# EAGLE design femtoBeacon_PRO_r3.0.2_single_sided (EAGLE 7.6.0)

## Sheet 1 of 2
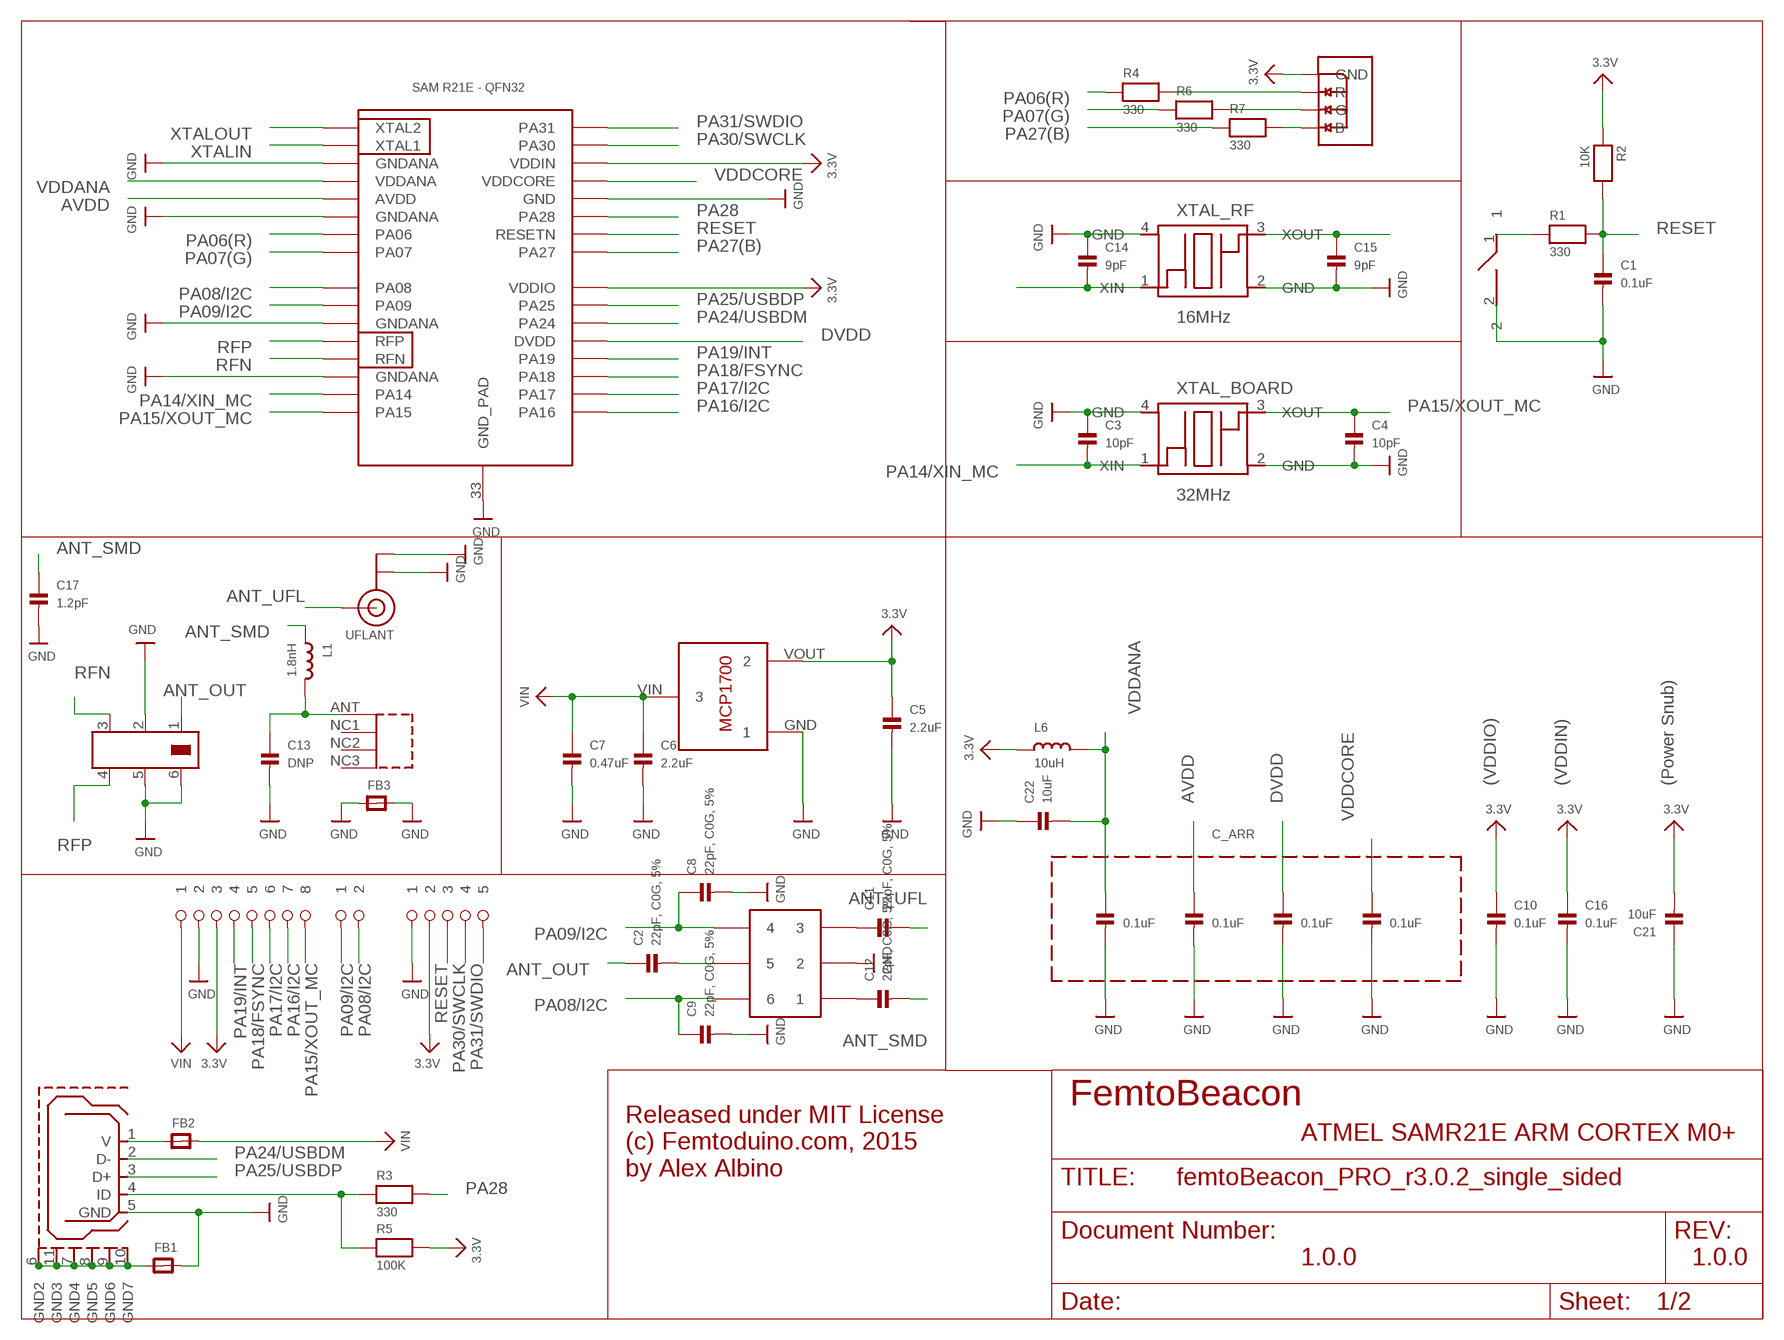
[diagram p0: schematic, sheet 1]

### Parts
ASWITCH  AS222-92LF  [AS222-92LF]
BALUN  JOHANSON_2450BM15A0015E  [0805_BALUN]
BTN_RESET  DNP  SPST_SMD  [SPST_SMD]
C1  0.1uF  CAP_CERAMIC_0402MP  [_0402MP]
C2  22pF, C0G, 5%  CAP_CERAMIC_0402MP  [_0402MP]
C3  10pF  CAP_CERAMIC_0402MP  [_0402MP]
C4  10pF  CAP_CERAMIC_0402MP  [_0402MP]
C5  2.2uF  CAP_CERAMIC_0402MP  [_0402MP]
C6  2.2uF  CAP_CERAMIC_0402MP  [_0402MP]
C7  0.47uF  CAP_CERAMIC_0402MP  [_0402MP]
C8  22pF, C0G, 5%  CAP_CERAMIC_0402MP  [_0402MP]
C9  22pF, C0G, 5%  CAP_CERAMIC_0402MP  [_0402MP]
C10  0.1uF  CAP_CERAMIC_0402MP  [_0402MP]
C11  22pF, C0G, 5%  CAP_CERAMIC_0402MP  [_0402MP]
C12  22pF, C0G, 5%  CAP_CERAMIC_0402MP  [_0402MP]
C13  DNP  CAP_CERAMIC_0402MP  [_0402MP]
C14  9pF  CAP_CERAMIC_0402MP  [_0402MP]
C15  9pF  CAP_CERAMIC_0402MP  [_0402MP]
C16  0.1uF  CAP_CERAMIC_0402MP  [_0402MP]
C17  1.2pF  CAP_CERAMIC_0402MP  [_0402MP]
C21  10uF  CAP_CERAMIC_0402MP  [_0402MP]
C22  10uF  CAP_CERAMIC_0402MP  [_0402MP]
C_ARR  0.1uF  KEMET_CERAMIC_CAPACITOR_ARRAY_1X4  [CAPACITOR_ARRAY_1206_MONO_1X4]
FB1  FERRITE_0603MP  [_0603MP]
FB2  FERRITE_0603MP  [_0603MP]
FB3  FERRITE_0603MP  [_0603MP]
IC  ATSAMR21E18A-MUT  [QFN32]
L1  1.8nH  INDUCTOR_0603MP  [_0603MP]
L6  10uH  INDUCTOR_0603MP  [_0603MP]
LDO_VREG  MCP1700T-3302E/TT  [MCP1700T-3302E/TT]
R1  330  RESISTOR_0402MP  [_0402MP]
R2  10K  RESISTOR_0402MP  [_0402MP]
R3  330  RESISTOR_0402MP  [_0402MP]
R4  330  RESISTOR_0402MP  [_0402MP]
R5  100K  RESISTOR_0402MP  [_0402MP]
R6  330  RESISTOR_0402MP  [_0402MP]
R7  330  RESISTOR_0402MP  [_0402MP]
RGBLED  LRTB_R48G  [LRTB_R48G]
U$5  1X8_ROUND  [1X8_ROUND]
U$9  1X2_ROUND  [1X2_ROUND]
U$10  1X5_ROUND  [1X5_ROUND]
U$12  0479480001  [0479480001]
UFLANT  ANTENNA_U.FL  [U.FL]
USB  USB_MICROB  [USB_MICROB_PACKAGE]
XTAL_BOARD  32MHz  FA-128  [FA-128]
XTAL_RF  16MHz  TSX-3225  [TSX-3225]

### Nets
3.3V: C5.1 C10.1 C16.1 C21.2 IC.24(VDDIO) IC.30(VDDIN) L6.1 LDO_VREG.VOUT R2.1 R5.2 RGBLED.1(GND) U$5.P$3 U$10.P$2 ; also sheet 2
ANT_OUT: BALUN.1 C2.1
ANT_SMD: C12.2 C17.1 L1.1
ANT_UFL: C11.2 UFLANT.3(SIGNAL)
AVDD: C_ARR.3 IC.5(AVDD)
DVDD: C_ARR.5 IC.21(DVDD)
GND: ASWITCH.PIN2 BALUN.2 BALUN.5 BALUN.6 BTN_RESET.2 C1.2 C3.1 C4.2 C5.2 C6.2 C7.2 C8.2 C9.2 C10.2 C13.2 C14.1 C15.2 C16.2 C17.2 C21.1 C22.1 C_ARR.2 C_ARR.4 C_ARR.6 C_ARR.8 FB1.2 FB3.1 FB3.2 IC.3(GNDANA) IC.6(GNDANA) IC.11(GNDANA) IC.14(GNDANA) IC.28(GND) IC.33(GND_PAD) LDO_VREG.GND U$5.P$2 U$10.P$1 UFLANT.1(GND) UFLANT.2(GND) USB.5(GND) XTAL_BOARD.2(GND) XTAL_BOARD.4(GND) XTAL_RF.2(GND) XTAL_RF.4(GND) ; also sheet 2
N$2: C13.1 L1.2 U$12.ANT
N$3: ASWITCH.PIN5 C2.2
N$5: FB1.1 USB.6(GND2) USB.7(GND4) USB.8(GND5) USB.9(GND6) USB.10(GND7) USB.11(GND3)
N$6: R3.1 R5.1 USB.4(ID)
N$7: FB2.1 USB.1(V)
N$8: R6.2 RGBLED.3(G)
N$9: R7.2 RGBLED.4(B)
N$10: ASWITCH.PIN3 C11.1
N$11: ASWITCH.PIN1 C12.1
N$13: R4.2 RGBLED.2(R)
N$26: BTN_RESET.1 R1.1
PA06(R): IC.7(PA06) R4.1
PA07(G): IC.8(PA07) R6.1
PA08/I2C: ASWITCH.PIN6 C9.1 IC.9(PA08) U$9.P$2
PA09/I2C: ASWITCH.PIN4 C8.1 IC.10(PA09) U$9.P$1
PA14/XIN_MC: C3.2 IC.15(PA14) XTAL_BOARD.1(XIN)
PA15/XOUT_MC: C4.1 IC.16(PA15) U$5.P$8 XTAL_BOARD.3(XOUT)
PA16/I2C: IC.17(PA16) U$5.P$7 ; also sheet 2
PA17/I2C: IC.18(PA17) U$5.P$6 ; also sheet 2
PA18/FSYNC: IC.19(PA18) U$5.P$5 ; also sheet 2
PA19/INT: IC.20(PA19) U$5.P$4 ; also sheet 2
PA24/USBDM: IC.22(PA24) USB.2(D-)
PA25/USBDP: IC.23(PA25) USB.3(D+)
PA27(B): IC.25(PA27) R7.1
PA28: IC.27(PA28) R3.2
PA30/SWCLK: IC.31(PA30) U$10.P$4
PA31/SWDIO: IC.32(PA31) U$10.P$5
RESET: C1.1 IC.26(RESETN) R1.2 R2.2 U$10.P$3
RFN: BALUN.3 IC.13(RFN)
RFP: BALUN.4 IC.12(RFP)
VDDANA: C22.2 C_ARR.1 IC.4(VDDANA) L6.2
VDDCORE: C_ARR.7 IC.29(VDDCORE)
VIN: C6.1 C7.1 FB2.2 LDO_VREG.VIN U$5.P$1
XTALIN: C14.2 IC.2(XTAL1) XTAL_RF.1(XIN)
XTALOUT: C15.1 IC.1(XTAL2) XTAL_RF.3(XOUT)
Unconnected: U$12.NC1 U$12.NC2 U$12.NC3

### Notes on the sheet
- (VDDIO) | (VDDIN) | (Power Snub)
- FemtoBeacon
- ATMEL SAMR21E ARM CORTEX M0+
- Released under MIT License
  (c) Femtoduino.com, 2015
  by Alex Albino
- 1.0.0 | 1.0.0

## Sheet 2 of 2
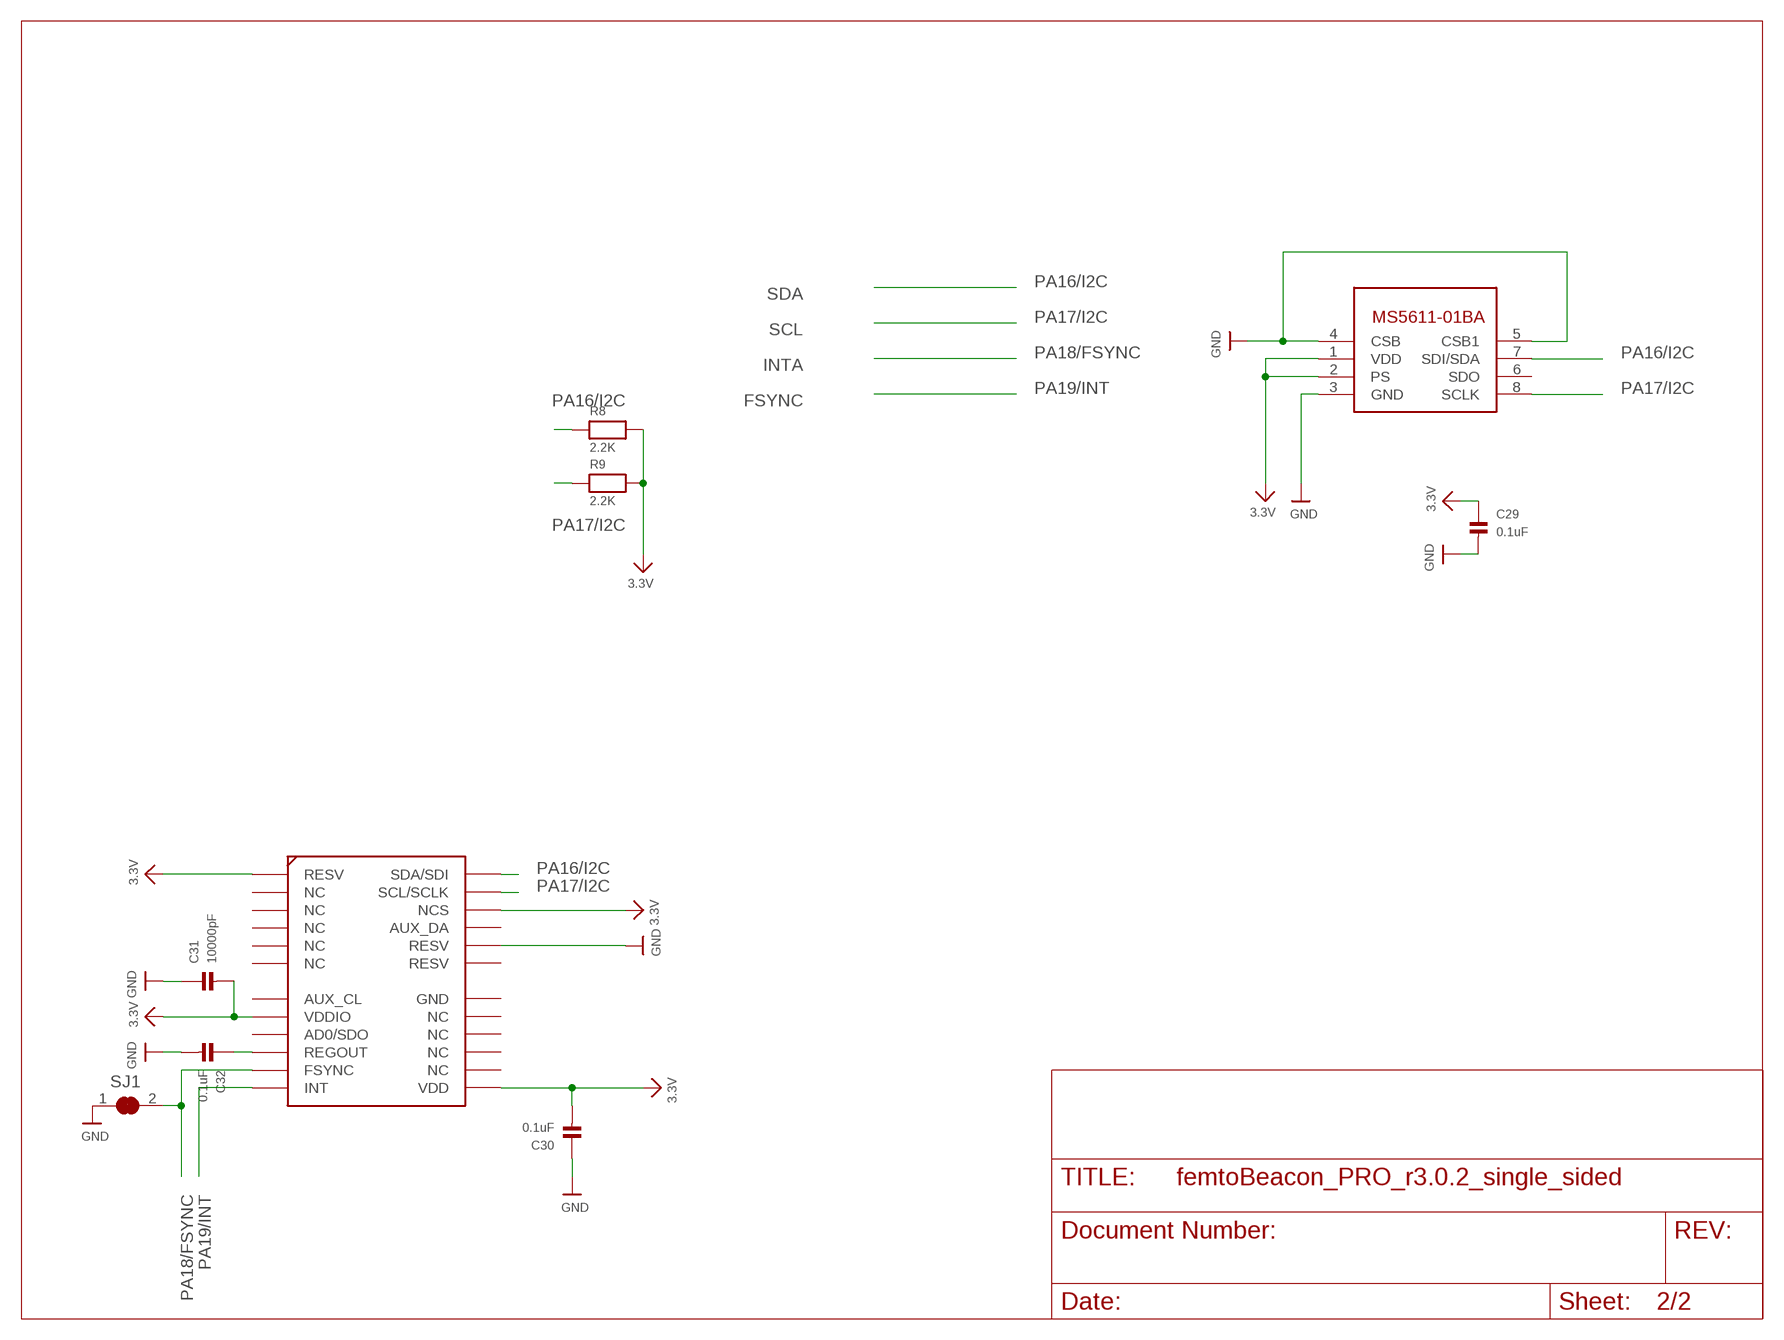
[diagram p1: schematic, sheet 2]

### Parts
BARO  MS5611-01BA03  [MS5611-01BA03]
C29  0.1uF  CAP_CERAMIC_0402MP  [_0402MP]
C30  0.1uF  CAP_CERAMIC_0402MP  [_0402MP]
C31  10000pF  CAP_CERAMIC_0402MP  [_0402MP]
C32  0.1uF  CAP_CERAMIC_0402MP  [_0402MP]
IMU  MPU-9250  [QFN_3X3MM]
R8  2.2K  RESISTOR_0402MP  [_0402MP]
R9  2.2K  RESISTOR_0402MP  [_0402MP]
SJ1  SOLDERJUMPER_CLOSED  [SOLDERJUMPER_CLOSEDWIRE]

### Nets
3.3V: BARO.1(VDD) BARO.2(PS) C29.1 C30.2 C31.2 IMU.P$1(RESV) IMU.P$8(VDDIO) IMU.P$13(VDD) IMU.P$22(NCS) R8.2 R9.2 ; also sheet 1
GND: BARO.3(GND) BARO.4(CSB) BARO.5(CSB1) C29.2 C30.1 C31.1 C32.2 IMU.P$20(RESV) SJ1.1 ; also sheet 1
N$4: C32.1 IMU.P$10(REGOUT)
PA16/I2C: BARO.7(SDI/SDA) IMU.P$24(SDA/SDI) R8.1 ; also sheet 1
PA17/I2C: BARO.8(SCLK) IMU.P$23(SCL/SCLK) R9.1 ; also sheet 1
PA18/FSYNC: IMU.P$11(FSYNC) SJ1.2 ; also sheet 1
PA19/INT: IMU.P$12(INT) ; also sheet 1
Unconnected: BARO.6(SDO) IMU.P$2(NC) IMU.P$3(NC) IMU.P$4(NC) IMU.P$5(NC) IMU.P$6(NC) IMU.P$7(AUX_CL) IMU.P$9(AD0/SDO) IMU.P$14(NC) IMU.P$15(NC) IMU.P$16(NC) IMU.P$17(NC) IMU.P$18(GND) IMU.P$19(RESV) IMU.P$21(AUX_DA)

### Notes on the sheet
- SDA
- SCL
- INTA
- FSYNC

## Library data of the parts
ASWITCH = skyworks_solutions:AS222-92LF
BALUN = balun:JOHANSON_2450BM15A0015E
BARO = freeimu:MS5611-01BA03
BTN_RESET = femtoduino:SPST_SMD
C1-C4 C8-C16 C29-C32 = microbuilder:CAP_CERAMIC: Ceramic Capacitors 0402 - 0402 Surface Mount Capacitors 16pF 50V 5% [Digikey: 445-4899-2-ND] 18pF 50V 5% [Digikey: 490-1281-2-ND] 22pF 50V 5% [Digikey: 490-1283-2-ND] 68pF 50V 5% [Digikey: 490-1289-2-ND] 0.1uF 10V 10% [Digikey: 490-1318-2-ND] 1.0uF 6.3V 10% [Digikey: 490-1320-2-ND] 0603 - 0603 Surface Mount Capacitors 16 pF 50V 5% [Digikey: 445-5051-2-ND] 22 pF 50V [Digikey: PCC220ACVTR-ND] 33 pF 50V 5% [Digikey: 490-1415-1-ND] 56pF 50V 5% [Digikey: 490-1421-1-ND] 220pF 50V 5% [Digikey: 445-1285-1-ND] 680 pF 50V 2200 pF 50V 5% C0G [Digikey: 445-1297-1-ND] 5600 pF 100V 5% X7R [Digikey: 478-3711-1-ND] 0.1 µF 25V 10% [Digikey: PCC2277TR-ND] 0.22 µF 16V 10% X7R [Digikey: 445-1318-1-ND] 1.0 µF 25V 10% [Digikey: 445-5146-2-ND] 0603 - RF Specific 3pF 250V +/-0.1pF RF [Digikey: 712-1347-1-ND] 18 pF 250V 5% [Digikey: 478-3505-1-ND or 712-1322-1-ND] 56 pF 250V 5% C0G RF [Digikey: 490-4867-1-ND] 68 pF 250V RF [Digikey: 490-4868-1-ND] 0805 - 0805 Surface Mount Capacitors 220 pF 250V 2% RF Ceramic Capacitor [Digikey: 712-1398-1-ND] 1000 pF 50V 2% NP0 Ceramic Capacitor [Digikey: 478-3760-1-ND] 0.1 µF 25V 10% Ceramic Capacitor [Digikey: PCC1828TR-ND] 1.0 µF 16V 10% Ceramic Capacitor[Digikey: 490-1691-2-ND] 10.0 µF 10V 10% Ceramic Capacitor[Digikey: 709-1228-1-ND] 10.0 uF 16V 10% Ceramic Capacitor [Digikey: 478-5165-2-ND] 47 uF 6.3V 20% Ceramic Capacitor [Digikey: 587-1779-1-ND or 399-5506-1-ND] 1206 - 1206 Surface Mount Capacitors 47uF 10V 20% Ceramic Capacitor [Digikey: 490-5528-1-ND or 399-5508-1-ND or 445-6010-1-ND] 100uF 6.3V -20%, +80% Y5V Ceramic Capacitor (Digikey: 490-4512-1-ND, Mouser: 81-GRM31CF50J107ZE1L); DIGIKEY_PART: 490-3194-1-ND
C5-C7 C17 C21 C22 = microbuilder:CAP_CERAMIC: Ceramic Capacitors 0402 - 0402 Surface Mount Capacitors 16pF 50V 5% [Digikey: 445-4899-2-ND] 18pF 50V 5% [Digikey: 490-1281-2-ND] 22pF 50V 5% [Digikey: 490-1283-2-ND] 68pF 50V 5% [Digikey: 490-1289-2-ND] 0.1uF 10V 10% [Digikey: 490-1318-2-ND] 1.0uF 6.3V 10% [Digikey: 490-1320-2-ND] 0603 - 0603 Surface Mount Capacitors 16 pF 50V 5% [Digikey: 445-5051-2-ND] 22 pF 50V [Digikey: PCC220ACVTR-ND] 33 pF 50V 5% [Digikey: 490-1415-1-ND] 56pF 50V 5% [Digikey: 490-1421-1-ND] 220pF 50V 5% [Digikey: 445-1285-1-ND] 680 pF 50V 2200 pF 50V 5% C0G [Digikey: 445-1297-1-ND] 5600 pF 100V 5% X7R [Digikey: 478-3711-1-ND] 0.1 µF 25V 10% [Digikey: PCC2277TR-ND] 0.22 µF 16V 10% X7R [Digikey: 445-1318-1-ND] 1.0 µF 25V 10% [Digikey: 445-5146-2-ND] 0603 - RF Specific 3pF 250V +/-0.1pF RF [Digikey: 712-1347-1-ND] 18 pF 250V 5% [Digikey: 478-3505-1-ND or 712-1322-1-ND] 56 pF 250V 5% C0G RF [Digikey: 490-4867-1-ND] 68 pF 250V RF [Digikey: 490-4868-1-ND] 0805 - 0805 Surface Mount Capacitors 220 pF 250V 2% RF Ceramic Capacitor [Digikey: 712-1398-1-ND] 1000 pF 50V 2% NP0 Ceramic Capacitor [Digikey: 478-3760-1-ND] 0.1 µF 25V 10% Ceramic Capacitor [Digikey: PCC1828TR-ND] 1.0 µF 16V 10% Ceramic Capacitor[Digikey: 490-1691-2-ND] 10.0 µF 10V 10% Ceramic Capacitor[Digikey: 709-1228-1-ND] 10.0 uF 16V 10% Ceramic Capacitor [Digikey: 478-5165-2-ND] 47 uF 6.3V 20% Ceramic Capacitor [Digikey: 587-1779-1-ND or 399-5506-1-ND] 1206 - 1206 Surface Mount Capacitors 47uF 10V 20% Ceramic Capacitor [Digikey: 490-5528-1-ND or 399-5508-1-ND or 445-6010-1-ND] 100uF 6.3V -20%, +80% Y5V Ceramic Capacitor (Digikey: 490-4512-1-ND, Mouser: 81-GRM31CF50J107ZE1L)
C_ARR = array-capacitor:KEMET_CERAMIC_CAPACITOR_ARRAY_1X4; MFR_ID: CA064C104K4RACTU
FB1-FB3 = microbuilder:FERRITE: Ferrite Bead 0603 MMZ1608B121C - 120 Ohm @ 100MHz, 600mA, 0.15 Ohm DC Resistance - Digikey: 445-2164-1-ND BK1608HW121-T - 120 Ohm, 600mA Ferrite Chip - Digikey: 587-1876-2-ND 0805 HZ0805B272R-10 - 2.7K Ohm @ 100MHz, 200mA, 0.8 Ohm DC Resistance - Digikey: 240-2504-1-ND (see also Murata BLM21BD272SN1L) MMZ2012Y152B - 1.5K Ohm @ 100MHz, 500mA, 0.4 Ohm DC Resistance - Digikey: 445-1560-1-ND - Mainly for high frequency (80-400MHz) MMZ2012R102A - 1K Ohm @ 100MHz, 500mA, 0.3 Ohm DC Resistance - Digikey: 445-1555-2-ND - More general purpose (10-200MHz)
IC = atmel-samr21:ATSAMR21E18A-MUT: This is the ATMEL SAMR21E QFN-32. ATSAMR21E18A
IMU = mpu9250:MPU-9250
L1 = microbuilder:INDUCTOR: Inductors 0603: 10nH Ceramic Inductor - microwire antenna/RF (Digikey: 712-1434-2-ND) 0805: 560nH Ceramic Inductor - RF (Digikey: 553-1047-1-ND) 270nH Ceramic Inductor - Q = 40@250MHz, +-5%, 1 Ohm DC Resistance (Digikey: 535-10506-2-ND) 1007 (2518 Metric) SMT: 10µH 10% 250mOhm 820mA 1007 Inductor (Digikey: 587-2189-1-ND) 22µH 10% 500mOhm 580mA 1007 Inductor (Digikey: 587-2190-1-ND) 47µH 10% 950mOhm 420mA 1007 Inductor (Digikey: 587-2191-1-ND) 47µH 5% 100mOhm 1A 1008 Inductor (Digikey: 732-1816-1-ND) 5.0x5.0mm (Taiyo Yuden NR5040 Series) 6.8µH 20% 2.3A 64mOhm Inductor (Digikey: 587-2374-2-ND) 5.0x5.0mm (TDK VLC5045 Series) 4.7µH 20% 3.3A 34mOhm Inductor (Digikey: 445-6526-1-ND) 6.8µH 20% 2.7A 46mOhm Inductor (Digikey: 445-6527-1-ND) 6.0x6.0mm (TDK VLC6045 Series) 4.7µH 20% 3.8A 27mOhm Inductor (Digikey: 445-6538-2-ND) 6.8µH 20% 3A 41mOhm Inductor (Digikey: 445-6540-1-ND) 6.2µH 30% 2.2A 45mOhm Inductor (Digikey: SRR5028-6R2YCT-ND) - Not TDK VLC6045 but footprint should match 6.0x6.0mm (TDK SLF6045 Series) 6.8uH 30% 2A 33mOhm Inductor (Digikey: 445-4572-1-ND, Mouser: 810-SLF645T6R8N2R0PF); MFR_ID: L-14C1N8SV4T
L6 = microbuilder:INDUCTOR: Inductors 0603: 10nH Ceramic Inductor - microwire antenna/RF (Digikey: 712-1434-2-ND) 0805: 560nH Ceramic Inductor - RF (Digikey: 553-1047-1-ND) 270nH Ceramic Inductor - Q = 40@250MHz, +-5%, 1 Ohm DC Resistance (Digikey: 535-10506-2-ND) 1007 (2518 Metric) SMT: 10µH 10% 250mOhm 820mA 1007 Inductor (Digikey: 587-2189-1-ND) 22µH 10% 500mOhm 580mA 1007 Inductor (Digikey: 587-2190-1-ND) 47µH 10% 950mOhm 420mA 1007 Inductor (Digikey: 587-2191-1-ND) 47µH 5% 100mOhm 1A 1008 Inductor (Digikey: 732-1816-1-ND) 5.0x5.0mm (Taiyo Yuden NR5040 Series) 6.8µH 20% 2.3A 64mOhm Inductor (Digikey: 587-2374-2-ND) 5.0x5.0mm (TDK VLC5045 Series) 4.7µH 20% 3.3A 34mOhm Inductor (Digikey: 445-6526-1-ND) 6.8µH 20% 2.7A 46mOhm Inductor (Digikey: 445-6527-1-ND) 6.0x6.0mm (TDK VLC6045 Series) 4.7µH 20% 3.8A 27mOhm Inductor (Digikey: 445-6538-2-ND) 6.8µH 20% 3A 41mOhm Inductor (Digikey: 445-6540-1-ND) 6.2µH 30% 2.2A 45mOhm Inductor (Digikey: SRR5028-6R2YCT-ND) - Not TDK VLC6045 but footprint should match 6.0x6.0mm (TDK SLF6045 Series) 6.8uH 30% 2A 33mOhm Inductor (Digikey: 445-4572-1-ND, Mouser: 810-SLF645T6R8N2R0PF)
LDO_VREG = MCP1700T-3302E_TT:MCP1700T-3302E/TT: Microchip LDO "MCP1700" in a 3-Pin SOT-23 package. ID: MCP1700T-3302E/TT
R1-R9 = microbuilder:RESISTOR: Resistors 0402 - 0402 Surface Mount Package 22 Ohm 1% 1/16W [Digikey: 311-22.0LRTR-ND] 33 Ohm 5% 1/16W 1.0K 5% 1/16W 1.5K 5% 1/16W 2.0K 1% 1/16W 10.0K 1% 1/16W [Digikey: 311-10.0KLRTR-ND] 10.0K 5% 1/16W [Digikey: RMCF0402JT10K0TR-ND] 12.1K 1% 1/16W [Digikey: 311-22.0LRTR-ND] 100.0K 5% 1/16W 0603 - 0603 Surface Mount Package 0 Ohm 1/10 Watt 1% Resistor 15 Ohm 1/10 Watt 1% Resistor 33 Ohm 1/10 Watt 1% Resistor 49.9 Ohm 1/10 Watt 1% Resistor 100 Ohm 1/10 Watt 1% Resistor 150 Ohm 1/10 Watt 1% Resistor 240 Ohm 1/10 Watt 1% Resistor 390 Ohm 1/10 Watt 1% Resistor 560 Ohm 1/10 Watt 1% Resistor 680 Ohm 1/10 Watt 1% Resistor 750 Ohm 1/10 Watt 1% Resistor 1.0K Ohm 1/10 Watt 1% Resistor 1.5K Ohm 1/10 Watt 1% Resistor 2.0K Ohm 1/10 Watt 1% Resistor 2.2K Ohm 1/10 Watt 1% Resistor 3.3K Ohm 1/10 Watt 1% Resistor 4.7K Ohm 1/10 Watt 1% Resistor 10.0K Ohm 1/10 Watt 1% Resistor 12.0K Ohm 1/10 Watt 1% Resistor 12.1K Ohm 1/10 Watt 1% Resistor 20.0K Ohm 1/10 Watt 1% Resistor 33.0K Ohm 1/10 Watt 1% Resistor 100.0K Ohm 1/10 Watt 1% Resistor 0805 - 0805 Surface Mount Package 0 Ohm 1/8 Watt 1% Resistor 33 Ohm 1/8 Watt 1% Resistor 100 Ohm 1/8 Watt 1% Resistor 150 Ohm 1/8 Watt 1% Resistor 200 Ohm 1/8 Watt 1% Resistor 240 Ohm 1/8 Watt 1% Resistor 330 Ohm 1/8 Watt 1% Resistor 390 Ohm 1/8 Watt 1% Resistor 470 Ohm 1/8 Watt 1% Resistor 1.0K Ohm 1/8 Watt 1% Resistor 1.5K Ohm 1/8 Watt 1% Resistor 2.0K Ohm 1/8 Watt 1% Resistor 4.7K Ohm 1/8 Watt 1% Resistor 5.1K Ohm 1/8 Watt 1% Resistor 5.6K Ohm 1/8 Watt 1% Resistor 10.0K Ohm 1/8 Watt 1% Resistor 22.0K Ohm 1/8 Watt 1% Resistor 33.0K Ohm 1/8 Watt 1% Resistor 100K Ohm 1/8 Watt 1% Resistor 1206 - 1206 Surface Mount Package 2012 - 2010 Surface Mount Package 0.11 Ohm 1/2 Watt 1% Resistor - Digikey: RHM.11UCT-ND
RGBLED = osram_opto_LED:LRTB_R48G; MFR_ID: LRTB R48G
SJ1 = microbuilder:SOLDERJUMPER_CLOSED: Solder Jumper - Closed These solder jumpers are closed by default CLOSEDWIRE - 10 mil trace between pads that can be cut and resoldered later CLOSEDPERM - 63 mil trace between pads for a permanent connection (used to 'bridge' two signals, a shameless hack for Eagle). Can double as a test point as well (no cream layer)
U$5 = pins_1.27mm_pitch:1X8_ROUND
U$9 = pins_1.27mm_pitch:1X2_ROUND
U$10 = pins_1.27mm_pitch:1X5_ROUND
U$12 = molex-antenna-2.4GHz:0479480001
UFLANT = adafruit:ANTENNA_U.FL: U.FL Antenna Connector
USB = femtoduino:USB_MICROB: This is the hirose ZX62-B-5PA(11) MICRO-USB B Type female connection.
XTAL_BOARD = crystals:FA-128
XTAL_RF = crystals:TSX-3225

## Board
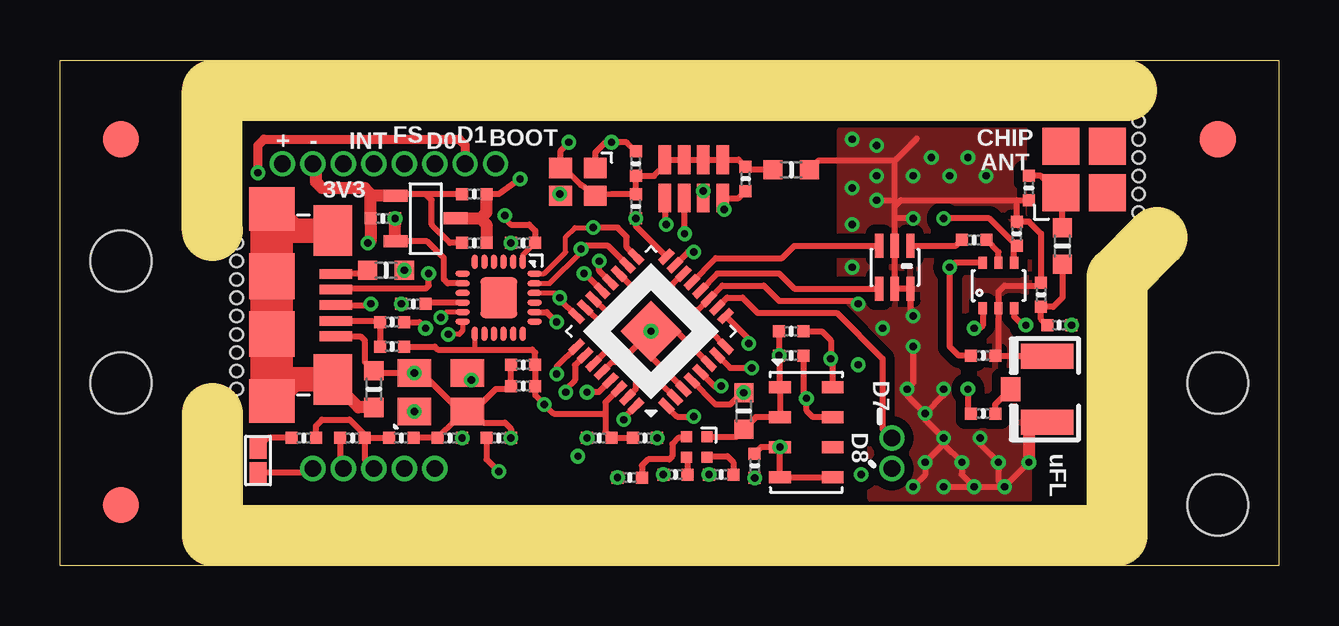
[diagram p2: board, top side]
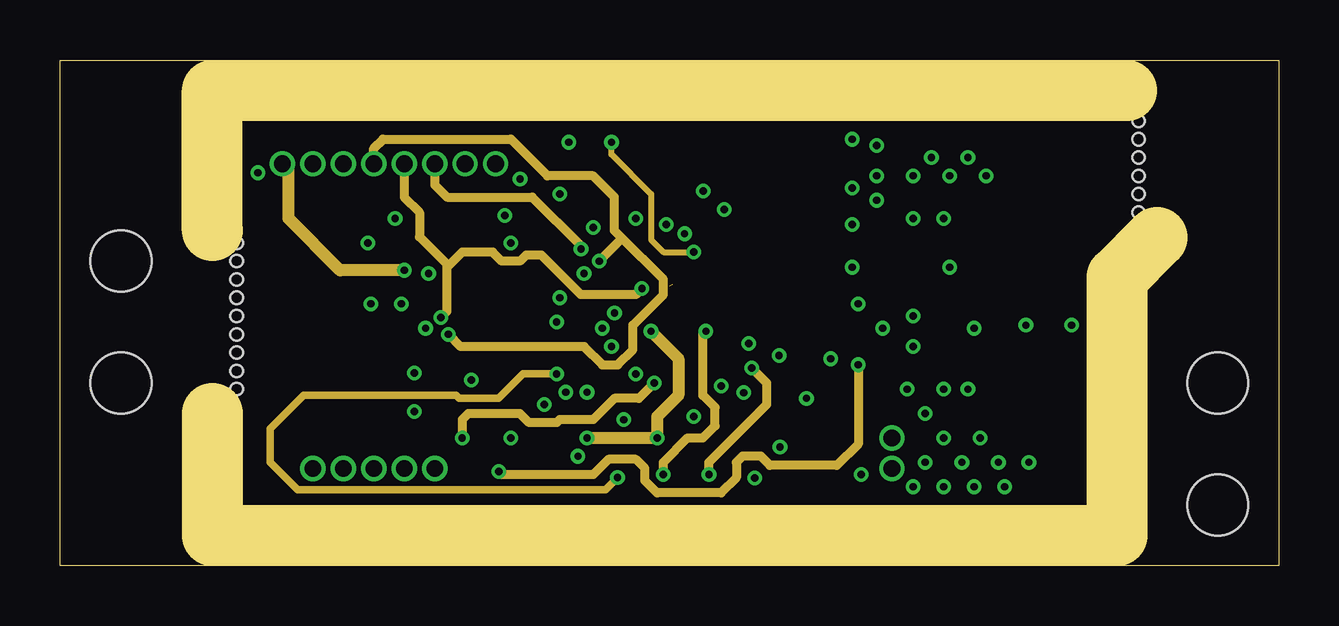
[diagram p3: board, inner layer Route2]
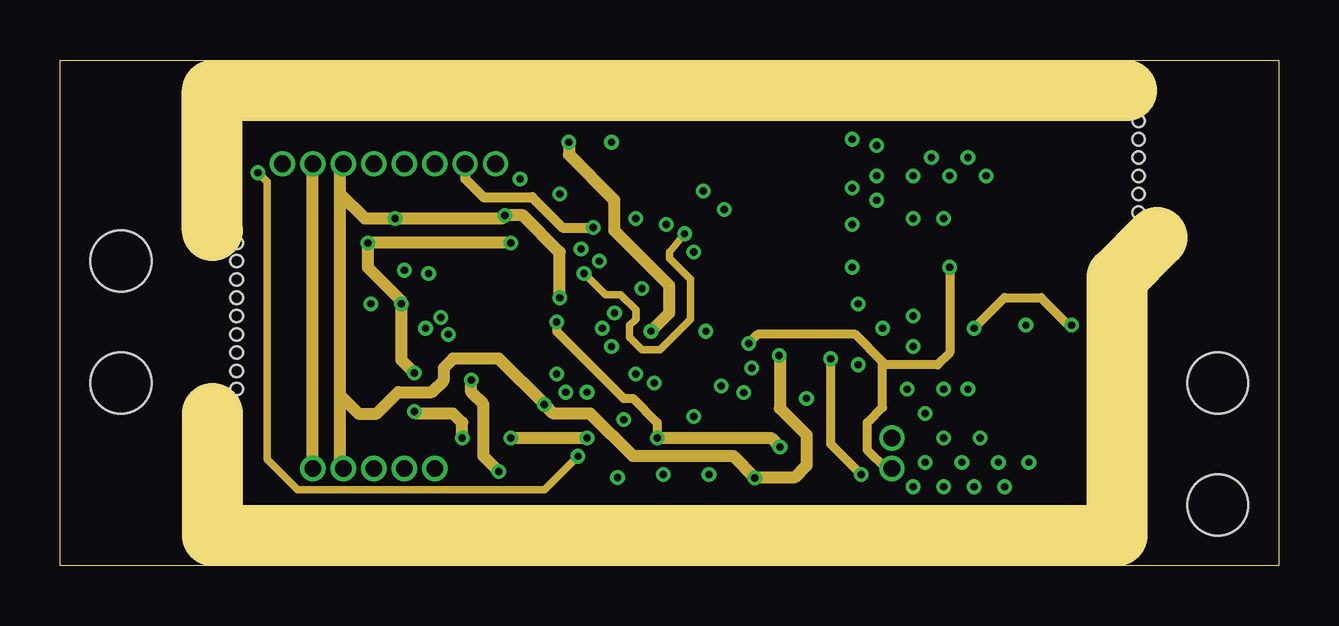
[diagram p4: board, inner layer Route15]
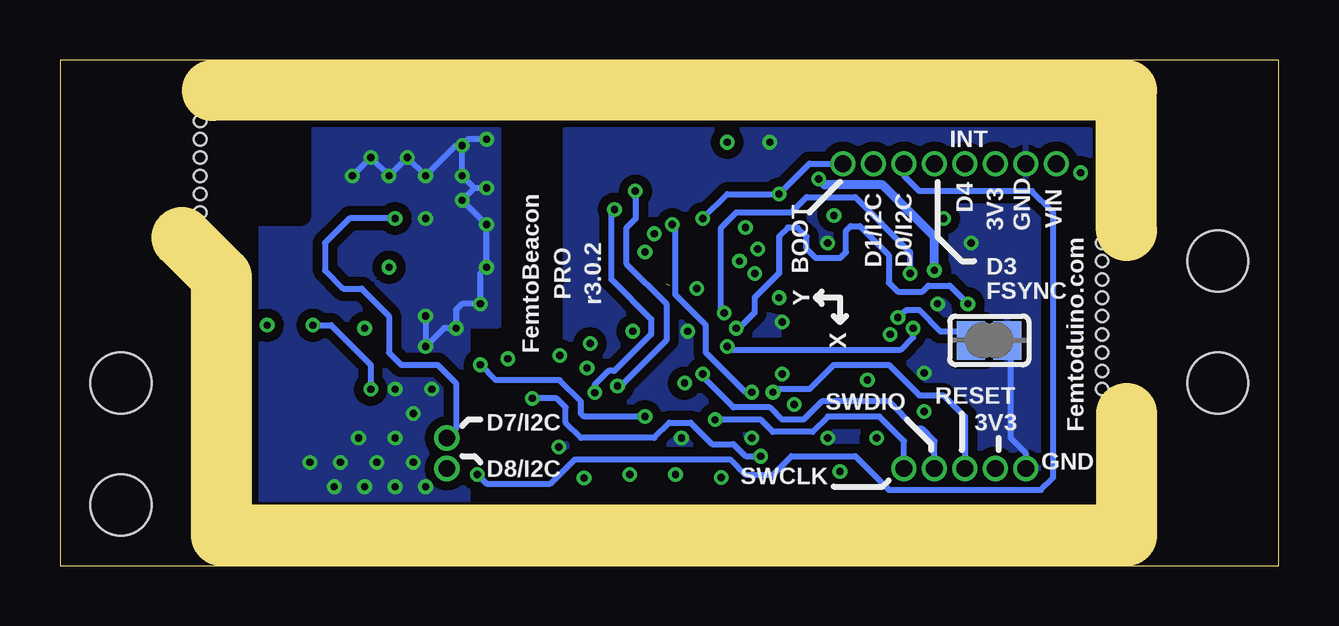
[diagram p5: board, bottom side, seen from below]

Size 50.8 x 21.08 mm. Coordinates in mm from the lower left corner, seen from the top.
Outline: 0,0 0,21.08 50.8,21.08 50.8,0 0,0
Copper layers (1*2*15*16): Top 0.035mm / dielectric 0.23mm / Route2 0.035mm / dielectric 0.93mm / Route15 0.035mm / dielectric 0.23mm / Bottom 0.035mm
Design rules "MF_Standard_4_Layer": minimum track width 6mil, minimum drill 12mil, track to track 6mil, track to pad 6mil, pad to pad 6mil, via to via 6mil, smd to smd 0mil, copper to edge 10mil, drill to drill 10mil, minimum pad ring 6mil, minimum via ring 6mil, stop-mask expansion 2mil, vias tented up to drill 25mil, thermal gap 10mil
Holes 2.54 mm at 2.54,7.62 2.54,12.7 48.26,7.62 48.26,2.54
Holes 0.51 mm at 44.96,18.54 44.96,17.78 44.96,17.02 44.96,16.26 44.96,15.49 44.96,14.73 7.37,13.46 7.37,12.7 7.37,11.94 7.37,11.18 7.37,10.41 7.37,9.65 7.37,8.89 7.37,8.13 7.37,7.37
tRestrict: area 40.8,14.6 to 44.6,18.5; area 16.8,9.7 to 19.8,12.7
bRestrict: area 40.8,14.6 to 44.6,18.5; area 16.8,9.7 to 19.8,12.7
Milling: 6 lines

### Footprints (pad centres in the part's own frame; a part is rotated, then mirrored left to right if it is on the bottom)
AS222-92LF = smd 0.35 x 0.5: PIN1 -0.65,-0.95; PIN2 0,-0.95; PIN3 0.65,-0.95; PIN4 0.65,0.95; PIN5 0,0.95; PIN6 -0.65,0.95
0805_BALUN = smd 1 x 0.35: 1 -0.9,0.65; 2 -0.9,0; 3 -0.9,-0.65; 4 0.9,-0.65; 5 0.9,0; 6 0.9,0.65
MS5611-01BA03 = smd 0.9 x 0.5: 1 -1.1,1.875; 2 -1.1,0.625; 3 -1.1,-0.625; 4 -1.1,-1.875; 5 1.1,-1.875; 6 1.1,-0.625; 7 1.1,0.625; 8 1.1,1.875
SPST_SMD = smd 0.889 x 0.699: 1 -0.508,0; 2 0.508,0
_0402MP = smd 0.5 x 0.5: 1 -0.508,0; 2 0.508,0
CAPACITOR_ARRAY_1206_MONO_1X4 = smd 0.52 x 1.2: 1 -1.2,0.8; 2 -1.2,-0.8; 3 -0.4,0.8; 4 -0.4,-0.8; 5 0.4,0.8; 6 0.4,-0.8; 7 1.2,0.8; 8 1.2,-0.8
_0603MP = smd 0.8 x 0.8: 1 -0.762,0; 2 0.762,0
FIDUCIAL_1MM = smd 1.5 x 1.5: 1 0,0
QFN32 = smd 0.7 x 0.3: 1 -2.65,1.75; 2 -2.65,1.25; 3 -2.65,0.75; 4 -2.65,0.25; 5 -2.65,-0.25; 6 -2.65,-0.75; 7 -2.65,-1.25; 8 -2.65,-1.75; 17 2.65,-1.75; 18 2.65,-1.25; 19 2.65,-0.75; 20 2.65,-0.25; 21 2.65,0.25; 22 2.65,0.75; 23 2.65,1.25; 24 2.65,1.75 | smd 0.3 x 0.7: 9 -1.75,-2.65; 10 -1.25,-2.65; 11 -0.75,-2.65; 12 -0.25,-2.65; 13 0.25,-2.65; 14 0.75,-2.65; 15 1.25,-2.65; 16 1.75,-2.65; 25 1.75,2.65; 26 1.25,2.65; 27 0.75,2.65; 28 0.25,2.65; 29 -0.25,2.65; 30 -0.75,2.65; 31 -1.25,2.65; 32 -1.75,2.65 | smd 1.8 x 1.8: 33 0,0
QFN_3X3MM = smd 0.6 x 0.25: P$1 -1.5,1; P$2 -1.5,0.6; P$3 -1.5,0.2; P$4 -1.5,-0.2; P$5 -1.5,-0.6; P$6 -1.5,-1; P$13 1.5,-1; P$14 1.5,-0.6; P$15 1.5,-0.2; P$16 1.5,0.2; P$17 1.5,0.6; P$18 1.5,1 | smd 0.25 x 0.6: P$7 -1,-1.5; P$8 -0.6,-1.5; P$9 -0.2,-1.5; P$10 0.2,-1.5; P$11 0.6,-1.5; P$12 1,-1.5; P$19 1,1.5; P$20 0.6,1.5; P$21 0.2,1.5; P$22 -0.2,1.5; P$23 -0.6,1.5; P$24 -1,1.5 | smd 1.7 x 1.54: P$25 0,0
MCP1700T-3302E/TT = smd 0.5 x 1: GND -0.95,-1.25; VIN 0,1.25; VOUT 0.95,-1.25
LRTB_R48G = smd 0.45 x 0.45: 1 0.425,0.425; 2 0.425,-0.425; 3 -0.425,-0.425; 4 -0.425,0.425
SOLDERJUMPER_CLOSEDWIRE = smd 1.168 x 1.6: 1 -0.762,0; 2 0.762,0 | smd 0.635 x 0.203: WIRE 0,0
1X8_ROUND = drill 0.7 pad 1: P$1 0,0; P$2 0,-1.27; P$3 0,-2.54; P$4 0,-3.81; P$5 0,-5.08; P$6 0,-6.35; P$7 0,-7.62; P$8 0,-8.89
1X2_ROUND = drill 0.7 pad 1: P$1 0,0; P$2 0,-1.27
1X5_ROUND = drill 0.7 pad 1: P$1 0,0; P$2 0,-1.27; P$3 0,-2.54; P$4 0,-3.81; P$5 0,-5.08
0479480001 = smd 1.54 x 1.54: ANT -0.963,0.963; NC1 0.978,0.963; NC2 0.978,-0.978; NC3 -0.963,-0.978
U.FL = smd 2.2 x 1.05: 1 0,1.375; 2 0,-1.375 | smd 0.8 x 1: 3 1.525,0
USB_MICROB_PACKAGE = smd 0.4 x 1.35: 1 -1.3,1.47; 2 -0.64,1.47; 3 0,1.47; 4 0.66,1.47; 5 1.3,1.47 | smd 2.1 x 1.6: 6 -3.1,1.35; 11 3.1,1.35 | smd 1.8 x 1.9: 7 -4,-1.2; 10 4,-1.2 | smd 1.9 x 1.9: 8 -1.2,-1.2; 9 1.2,-1.2
FA-128 = smd 0.95 x 0.85: 1 -0.725,-0.575; 2 0.725,-0.575; 3 0.725,0.575; 4 -0.725,0.575
TSX-3225 = smd 1.4 x 1.15: 1 -1.1,-0.8; 2 1.1,-0.8; 3 1.1,0.8; 4 -1.1,0.8

### Placement (x,y rotation side)
ASWITCH  39.12,11.68 0 top
BALUN  34.8,12.45 270 top
BARO  31.11,5.58 0 top
BTN_RESET  8.26,4.39 270 top
C1  14.22,5.33 0 top
C2  38.1,13.59 0 top
C3  24,16.76 90 top
C4  24,14.99 90 top
C5  13.46,14.48 180 top
C6  17.27,15.49 180 top
C7  17.27,13.46 180 top
C8  39.88,13.84 90 top
C9  38.48,8.76 0 top
C10  19.3,13.46 180 top
C11  38.48,6.35 0 top
C12  41.66,10.03 180 top
C13  40.39,15.75 270 top
C14  16.26,5.33 0 top
C15  18.29,5.33 0 top
C16  24.38,5.33 0 top
C17  40.89,11.3 90 top
C21  22.48,5.33 0 top
C22  28.57,16.13 270 top
C29  28.96,4.18 90 top
C30  19.3,7.49 0 top
C31  19.3,8.38 0 top
C32  14.73,10.92 180 top
C_ARR  26.42,16.13 180 top
FB1  13.08,7.37 90 top
FB2  13.59,12.32 0 top
FB3  30.48,16.51 0 top
FID1  [FIDUCIAL_1MM]  2.54,2.54 0 top
FID2  [FIDUCIAL_1MM]  2.54,17.78 0 top
FID3  [FIDUCIAL_1MM]  48.26,17.78 0 top
IC  24.64,9.78 135 top
IMU  18.29,11.18 270 top
L1  41.78,13.34 90 top
L6  28.51,6.46 90 top
LDO_VREG  15.24,14.48 270 top
R1  10.16,5.33 0 top
R2  12.19,5.33 0 top
R3  13.84,10.16 0 top
R4  27.56,3.81 0 top
R5  13.84,9.14 0 top
R6  25.65,3.81 0 top
R7  23.75,3.68 0 top
R8  30.48,8.76 180 top
R9  30.48,9.78 180 top
RGBLED  26.54,4.95 0 top
SJ1  12.06,9.4 180 bottom
U$5  9.27,16.76 90 top
U$9  34.67,5.33 0 top
U$10  10.54,4.06 90 top
U$12  42.67,16.51 90 top
UFLANT  41.15,7.37 180 top
USB  10.03,10.87 270 top
XTAL_BOARD  21.59,16 180 top
XTAL_RF  15.88,7.24 0 top

### Tracks (layer width: path | path; a pad name or v marks a point on that pad's centre or on a via)
3.3V  (via drill 0.3 pad 0.51)
  Top 0.203: IMU.P$13 17.27,9.66 17.27,9.02 | IMU.P$22 20.63,11.38 v20.83,11.18 | IMU.P$1 19.29,12.94 C10.1
  Top 0.254: IMU.P$8 16.16,11.78 16,11.94 16,12.83 15.3,13.53 LDO_VREG.VOUT | IC.24 20.83,11.11 v20.83,11.18 | v18.54,14.61 18.54,14.48 18.8,14.22 19.56,14.22 19.81,13.97 C10.1 | IC.30 22.73,6.81 22.73,6.35 | R2.1 11.68,4.19 U$10.P$2 | R5.2 15.62,9.14 15.75,9.02 17.27,9.02 19.68,9.02 19.81,8.89 C31.2 C30.2 19.81,7.11 v20.19,6.73 20.57,6.35 22.73,6.35 | C16.1 C21.2 22.73,5.59 22.73,6.35 | RGBLED.1 28.19,5.38 L6.1 29.01,6.2 BARO.2 BARO.1 30.01,8.73 R8.2 R9.2
  Top 0.508: LDO_VREG.VOUT 13.97,13.55 C5.1
  Route15 0.508: 11.68,7.11 12.45,6.35 13.21,6.35 14.1,7.24 15.49,7.24 16,7.75 16,8.26 16.38,8.64 18.29,8.64 v20.19,6.73 20.57,6.35 22.1,6.35 23.88,4.57 28.07,4.57 28.95,3.68 C29.1 28.97,3.68 30.61,3.68 31.11,4.19 31.11,5.46 30.01,6.57 30.01,8.73 R8.2 | 11.68,7.11 11.68,15.49 | 11.68,15.49 11.68,16.64 U$5.P$3 | 11.68,15.49 12.7,14.48 C5.1 18.41,14.48 v18.54,14.61 19.3,14.61 20.83,13.08 v20.83,11.18 | U$10.P$2 11.68,4.19 11.68,7.11
  other vias: 13.97,14.48 28.96,3.67 29.97,8.76
ANT_OUT
  Top 0.254: BALUN.1 37.35,13.35 C2.1
ANT_SMD
  Top 0.254: L1.1 41.78,11.18 41.4,10.79 C17.1 40.89,10.29 C12.2
ANT_UFL
  Top 0.254: C11.2 38.99,6.73 UFLANT.3
AVDD  (via drill 0.3 pad 0.51)
  Top 0.254: IC.5 27.28,7.49 v27.56,7.49 | v26.82,15.62 C_ARR.3
  Bottom 0.254: v27.56,7.49 27.43,7.49 25.53,9.4 25.53,10.92 27.18,12.57 27.18,14.1 26.8,14.48 26.8,15.31 C_ARR.3 v26.82,15.62
DVDD  (via drill 0.3 pad 0.51)
  Top 0.254: IC.21 21.87,12.19 v21.84,12.19 | C_ARR.5 26.02,13.99 v26.04,13.84
  Route15 0.305: v21.84,12.19 22.73,11.3 23.37,11.3 24,10.67 24,10.29 23.75,10.03 23.75,9.53 24.26,9.02 25.02,9.02 26.29,10.29 26.29,11.94 25.4,12.83 25.4,13.08 v26.04,13.84
GND  (via drill 0.3 pad 0.51)  (1 unrouted)
  Top 0.254: C6.2 15.24,15.49 | 15.24,15.49 14.06,15.49 LDO_VREG.GND | C7.2 16.26,13.46 15.49,14.22 15.49,15.24 15.24,15.49 | USB.5 12.53,9.57 12.7,9.4 12.7,8.51 FB1.2 13.17,8.04 XTAL_RF.4 14.94,7.87 15.24,7.87 16.68,6.44 XTAL_RF.2 | U$10.P$1 10.36,3.89 BTN_RESET.2 | C1.2 C14.1 16.51,6.1 16.63,6.1 XTAL_RF.2 | C29.2 29.22,4.95 BARO.3 BARO.4 30.03,3.68 32.19,3.68 BARO.5 | IC.3 24.64,8.72 IC.33 | IC.28 23.01,8.51 23.37,8.51 IC.33 | IC.6 25.7,9.78 | 25.7,9.78 IC.33 | 25.7,9.78 IC.33 | 24.64,10.84 IC.33 | XTAL_RF.2 17.18,6.44 17.65,5.97 18.54,5.97 18.8,5.71 C15.2 | C31.1 C30.1 18.67,7.37 18.16,7.37 17.23,6.44 XTAL_RF.2 | IMU.P$20 20.29,10.58 v20.7,10.16 | 34.8,14.48 BALUN.2 BALUN.5 BALUN.6 35.45,10.53 v35.56,10.41 | 34.8,14.48 34.8,14.99 | 34.8,14.99 34.8,15.24 | 34.8,15.24 34.8,16.89 | 34.8,16.89 35.72,17.81 | 34.8,16.89 31.62,16.89 FB3.2 | FB3.1 28.7,16.51 C22.1 28.28,16.93 C_ARR.2 C_ARR.4 C_ARR.6 C_ARR.8 25.22,16.71 24.77,16.26 C3.1 C4.2 22.98,15.49 XTAL_BOARD.4 22.27,15.62 22.1,15.62 21.72,15.88 20.79,16.8 XTAL_BOARD.2 20.86,17.31 v21.21,17.65 | 34.8,14.99 35.05,15.24 39.88,15.24 | UFLANT.2 39.01,8.74 C9.2 39.12,8.89 ASWITCH.PIN2 39.12,11.43 39.37,11.68 40.77,11.68 C17.2 40.89,13.84 40.39,14.35 C8.2 39.88,15.24 | v35.56,14.48 34.8,14.48 | v34.04,15.24 34.8,15.24 | v35.56,9.14 35.56,7.62 v35.31,7.37 35.31,7.11 v36.07,6.35 | v36.83,7.37 36.83,7.11 v36.07,6.35 | v36.07,6.35 36.07,6.1 v36.83,5.33 36.83,5.08 | 36.83,5.08 v36.07,4.32 36.07,3.81 v35.56,3.3 | 36.83,5.08 v37.59,4.32 37.59,3.81 v38.1,3.3 | v36.83,3.3 v38.1,3.3 | v38.1,3.3 v39.37,3.3 | v40.39,4.32 v39.37,3.3 | v38.35,5.33 38.35,5.08 v39.12,4.32 39.12,3.56 v39.37,3.3
  Top 0.254: 39.88,15.24 C13.2 | v33.27,10.92 33.15,11.05 29.97,11.05 29.34,11.68 27.6,11.68 IC.11 26.59,10.67 26.29,10.67 25.53,11.43 25.53,11.73 IC.14
  Top 0.508: LDO_VREG.GND 13.02,15.43 | 13.02,15.43 12.7,15.75 10.92,15.75 10.67,16 10.67,16.64 U$5.P$2 | 13.02,15.43 12.95,15.36 C5.2 12.95,13.59 v12.83,13.46 | UFLANT.1 40.66,5.99 40.39,5.71 v40.39,4.32
  Route2 0.508: IC.33 25.78,8.64 25.78,7.11 24.89,6.22 C16.2 C21.1
  Route15 0.381: v20.7,10.16 20.7,9.78 23.5,6.99 23.88,6.99 24.89,5.97 C16.2
  Route15 0.508: C10.2 v12.83,13.46 12.83,12.45 14.22,11.05 C32.2 14.22,8.59 XTAL_RF.4 | IC.33 25.4,10.54 25.4,11.68 23.11,13.97 23.11,15.24 21.21,17.14 v21.21,17.65 | C15.2 C21.1 | C16.2 29.63,5.33 BARO.3 | U$10.P$1 U$5.P$2
  Bottom 0.254: v38.61,16.26 v37.85,17.02 v37.08,16.26 v36.32,17.02 v35.56,16.26 34.29,17.53 v34.04,17.53 | v33.02,17.78 33.78,17.78 v34.04,17.53 | v34.04,17.53 v34.04,16.26 33.53,15.75 | v33.02,15.75 33.53,15.75 | 33.53,15.75 v34.04,15.24 v33.02,14.22 v33.02,12.45 33.27,12.19 v33.27,10.92 34.04,10.92 34.29,10.67 v34.29,9.91 34.8,9.91 v35.56,9.14 v35.56,10.41 | SJ1.1 11.18,9.27 11.18,5.33 10.54,4.7 U$10.P$1
  other vias: 14.22,10.92 14.78,8.04 24.64,9.78 18.8,13.46 21.97,5.33 24.89,5.33 18.8,5.33 30.01,4.95
  pour Bottom (isolate 0.381): 7.87,18.16 29.72,18.16 29.72,11.94 20.83,11.94 20.83,13.46 15.75,13.46 15.75,12.95 16,12.95 16,8.89 20.83,8.89 20.83,11.68 29.72,11.68 29.72,2.79 7.87,2.79
  pour Top (isolate 0.381): 32.51,18.16 40.39,18.16 40.39,2.79 33.78,2.79 33.78,10.03 32.51,10.03
  pour Bottom (isolate 0.381): 32.51,18.16 40.64,18.16 40.64,14.48 42.42,14.48 42.42,2.79 33.78,2.79 33.78,10.03 32.51,10.03
N$2
  Top 0.254: C13.1 40.89,16.26 41.6,15.55 U$12.ANT 41.78,15.47 L1.2
N$3
  Top 0.254: ASWITCH.PIN5 39.12,13.08 C2.2
N$4
  Top 0.254: IMU.P$10 15.29,10.98 C32.1
N$5
  Top 0.508: FB1.1 12.45,6.6 11.94,7.11 11.94,7.22 USB.11
  Top 1.016: USB.6 9.73,13.97 USB.7 | USB.11 9.73,7.77 USB.10
  Top 1.778: USB.7 USB.8 USB.9 USB.10
N$6
  Top 0.254: USB.4 13.03,10.21 R3.1 R5.1
N$7
  Top 0.254: FB2.1 12.68,12.17 USB.1
N$8
  Top 0.254: RGBLED.3 26.16,4.48 R6.2
N$9
  Top 0.254: RGBLED.4 26.07,5.33 25.78,5.33 25.53,5.08 25.53,4.57 25.4,4.45 24.51,4.45 24.26,4.19 R7.2
N$10  (via drill 0.3 pad 0.51)
  Top 0.254: ASWITCH.PIN3 39.77,10.4 40.13,10.03 v40.26,10.03 | v37.85,7.37 37.85,6.48 C11.1
  Bottom 0.254: v40.26,10.03 39.5,10.03 37.85,8.38 v37.85,7.37
N$11  (via drill 0.3 pad 0.51)
  Top 0.254: ASWITCH.PIN1 38.47,10.02 38.35,9.91 v38.1,9.91
  Route15 0.381: v38.1,9.91 39.37,11.18 40.89,11.18 42.04,10.03 C12.1
  other vias: 42.16,10.03
N$13
  Top 0.254: RGBLED.2 27.01,4.57 27.81,4.57 28.07,4.32 R4.2
N$26
  Top 0.254: R1.1 8.69,5.33 BTN_RESET.1
PA06(R)  (via drill 0.3 pad 0.51)
  Top 0.254: IC.7 27.93,8.26 v28.83,8.26
  Route2 0.381: R4.1 27.05,4.32 29.46,6.73 29.46,7.62 v28.83,8.26
  other vias: 27.05,3.81
PA07(G)  (via drill 0.3 pad 0.51)
  Top 0.254: IC.8 27.11,9.78 v26.92,9.78
  Route2 0.381: R6.1 25.15,4.32 26.16,5.33 26.8,5.33 27.3,5.84 27.3,6.6 26.8,7.11 26.8,9.65 v26.92,9.78
  other vias: 25.15,3.81
PA08/I2C  (via drill 0.3 pad 0.51)
  Top 0.254: IC.9 28.7,9.46 v28.7,9.27 | ASWITCH.PIN6 37.27,12.63 v37.08,12.45 37.08,9.14 37.47,8.76 C9.1
  Route15 0.381: U$9.P$2 34.42,4.06 33.66,4.83 33.66,5.97 34.29,6.6 34.29,8.38 | v28.7,9.27 29.08,9.65 33.15,9.65 34.29,8.51 34.29,8.38 | v37.08,12.45 37.08,8.89 36.58,8.38 34.29,8.38
PA09/I2C  (via drill 0.3 pad 0.51)
  Top 0.254: IC.10 27.8,11.18 28.45,11.18 29.08,10.54 32.38,10.54 34.29,8.64 34.29,5.71 U$9.P$1 | ASWITCH.PIN4 39.77,13.22 C8.1 38.73,14.48 v36.83,14.48
  Bottom 0.254: v36.83,14.48 38.73,14.48 39.75,13.46 39.75,12.32 38.99,11.56 38.23,11.56 37.08,10.41 37.08,8.89 36.58,8.38 35.05,8.38 34.29,7.62 34.29,5.71 U$9.P$1
PA14/XIN_MC  (via drill 0.3 pad 0.51)
  Top 0.254: IC.15 26.17,13.08 v26.42,13.08 | C3.2 23.62,17.65 v22.99,17.65 22.73,17.65 22.32,17.23 XTAL_BOARD.1
  Route2 0.254: v26.42,13.08 25.15,13.08 24.64,13.59 24.64,15.49 22.99,17.14 v22.99,17.65
PA15/XOUT_MC  (via drill 0.3 pad 0.51)
  Top 0.254: XTAL_BOARD.3 20.54,15.2 v20.83,15.49 | IC.16 24,14.16 C4.1
  Bottom 0.254: U$5.P$8 19.56,16.76 v20.83,15.49 22.99,15.49 C4.1
  other vias: 24,14.48
PA16/I2C  (via drill 0.3 pad 0.51)
  Top 0.203: IMU.P$24 20.18,12.18 21.08,13.08 21.08,13.72 21.46,14.1 v22.23,14.1
  Top 0.254: BARO.7 31.39,6.2 31.11,6.48 v31.11,6.99 30.99,7.11 R8.1 | IC.17 23.62,13.27 23.62,13.72 23.24,14.1 v22.23,14.1
  Top 0.381: v8.26,16.38 8.26,17.53 8.51,17.78 16.64,17.78 16.89,17.53 U$5.P$7
  Route15 0.305: v8.26,16.38 8.64,16 8.64,4.45 9.91,3.17 20.19,3.17 v21.59,4.57
  Route15 0.406: U$5.P$7 16.89,16.13 17.65,15.37 19.68,15.37 20.95,14.1 v22.23,14.1
  Bottom 0.254: v31.11,6.99 30.1,6.99 29.72,6.6 29.72,5.97 29.08,5.33 26.04,5.33 25.4,5.97 24.51,5.97 23.62,5.08 22.73,5.08 22.23,4.57 v21.59,4.57
PA17/I2C  (via drill 0.3 pad 0.51)
  Top 0.203: IMU.P$23 20.41,11.78 21.72,13.08 v21.72,13.21
  Top 0.254: BARO.8 32.21,8.56 v32.13,8.64 32.13,9.4 31.75,9.78 R9.1 | IC.18 22.85,13.34 21.84,13.34 v21.72,13.21
  Route2 0.381: U$5.P$6 15.62,15.88 16.13,15.37 19.68,15.37 21.72,13.34 v21.72,13.21
  Route15 0.381: v33.4,3.81 32.13,5.08 v32.13,8.64
  Bottom 0.254: U$5.P$6 15.62,16.26 14.99,15.62 10.29,15.62 9.4,14.73 9.4,3.68 9.91,3.17 16.26,3.17 17.65,4.57 20.32,4.57 21.08,3.81 22.23,3.81 22.86,4.45 29.34,4.45 30.35,3.43 33.02,3.43 v33.4,3.81
PA18/FSYNC  (via drill 0.3 pad 0.51)
  Top 0.203: IMU.P$11 16.1,10.58 v15.88,10.35
  Top 0.254: IC.19 23.92,11.56 v24.26,11.56
  Route2 0.381: U$5.P$5 14.35,15.37 14.99,14.73 14.99,13.72 16.13,12.57 16.13,12.45 | v24.26,11.56 24,11.3 21.72,11.3 20.07,12.95 19.43,12.95 19.18,12.7 18.41,12.7 18.03,13.08 16.76,13.08 16.13,12.45 | v15.88,10.35 16.13,10.6 16.13,12.45
  Bottom 0.254: v15.88,10.35 15.88,10.41 15.49,10.67 14.99,10.67 14.1,9.78 13.21,9.78 SJ1.2
PA19/INT  (via drill 0.3 pad 0.51)
  Top 0.203: IMU.P$12 16.79,9.8 16.64,9.65 v16.19,9.65
  Top 0.254: IC.20 22.48,12.29 v22.48,12.7
  Route2 0.381: v16.19,9.65 16.7,9.14 21.84,9.14 22.61,8.38 23.24,8.38 23.88,9.02 23.88,10.03 25.15,11.3 25.15,11.94 23.37,13.72 | U$5.P$4 13.08,17.4 13.46,17.78 18.8,17.78 20.32,16.26 22.23,16.26 23.11,15.37 23.11,13.97 23.37,13.72 | v22.48,12.7 23.37,13.59 23.37,13.72
PA24/USBDM  (via drill 0.3 pad 0.51)
  Top 0.254: USB.2 11.55,11.56 15.24,11.56 15.37,11.68 v15.37,12.19 | IC.22 22.82,10.54 v23.11,10.54
  Bottom 0.254: v23.11,10.54 23.24,10.67 23.24,14.1 22.61,14.73 20.32,14.73 19.68,15.37 17.65,15.37 15.37,13.08 v15.37,12.19
PA25/USBDP  (via drill 0.3 pad 0.51)
  Top 0.254: USB.3 12.9,10.87 v12.95,10.92 | IC.23 22.61,10.04 v22.61,9.91
  Bottom 0.254: v22.61,9.91 22.48,9.92 21.84,10.55 21.84,11.18 20.83,12.19 20.83,13.73 20.46,14.1 20.05,14.1 19.68,13.73 19.68,13.21 19.3,12.83 18.29,12.83 18.03,13.08 18.03,13.97 17.84,14.16 17.46,14.16 16.26,12.95 16.26,11.81 15.88,11.43 14.86,11.43 14.61,11.68 13.72,11.68 v12.95,10.92
PA27(B)  (via drill 0.3 pad 0.51)
  Top 0.254: IC.25 20.7,8.32 v20.7,8
  Route2 0.305: v20.7,8 19.3,8 18.29,6.99 16.64,6.99 16.51,7.11 10.16,7.11 8.76,5.71 8.76,4.32 9.91,3.17 22.73,3.17 R7.1
  other vias: 23.24,3.68
PA28  (via drill 0.3 pad 0.51)
  Top 0.254: R3.2 14.99,10.16 v15.24,9.91 | IC.27 22.94,9.14 v22.99,9.14
  Bottom 0.254: v22.99,9.14 22.86,9.02 15.75,9.02 15.24,9.53 v15.24,9.91
PA30/SWCLK  (via drill 0.3 pad 0.51)
  Top 0.254: IC.31 24,7.38 v24,8
  Bottom 0.254: U$10.P$4 14.35,5.21 14.86,5.71 15.11,5.71 16.26,6.86 19.05,6.86 19.81,6.1 20.7,6.1 21.21,6.6 22.73,6.6 24,7.87 v24,8
PA31/SWDIO  (via drill 0.3 pad 0.51)
  Top 0.254: IC.32 23.5,6.16 v23.5,6.1
  Bottom 0.254: U$10.P$5 15.62,5.21 16.64,6.22 18.8,6.22 19.43,5.59 21.08,5.59 21.59,6.1 v23.5,6.1
RESET  (via drill 0.3 pad 0.51)
  Top 0.254: R2.2 12.7,4.45 U$10.P$3 | R2.2 C1.1 | R1.2 10.67,5.84 10.92,6.1 12.06,6.1 12.7,5.46 R2.2 | IC.26 21.46,8.37 21.46,7.75 21.08,7.37 v21.08,7.24
  Bottom 0.254: v21.08,7.24 20.95,7.37 19.56,7.37 18.54,8.38 16.26,8.38 14.99,7.11 13.97,7.11 13.08,6.22 U$10.P$3
RFN
  Top 0.254: IC.13 27.33,12.83 30.1,12.83 30.61,13.34 34.14,13.34 BALUN.3
RFP
  Top 0.254: IC.12 27.41,12.19 29.97,12.19 30.61,11.56 34.14,11.56 BALUN.4
VDDANA  (via drill 0.3 pad 0.51)
  Top 0.254: C22.2 28.28,15.33 C_ARR.1 27.62,14.93 v27.69,14.86 | IC.4 27.33,6.73 27.94,6.73 28.43,7.22 L6.2
  Bottom 0.254: L6.2 28.5,7.56 27.94,8.13 27.69,8.13 26.16,9.65 26.16,10.29 27.81,11.94 27.81,14.73 v27.69,14.86
  other vias: 28.51,7.22
VDDCORE  (via drill 0.3 pad 0.51)
  Top 0.254: C_ARR.7 25.22,14.28 v25.27,14.22 | IC.29 22.45,7.24 v21.97,7.24
  Bottom 0.254: v21.97,7.24 22.23,7.24 23.88,8.89 23.88,10.03 25.15,11.3 25.15,14.1 v25.27,14.22
VIN  (via drill 0.3 pad 0.51)
  Top 0.254: v19.18,16.13 18.29,15.49 C6.1
  Top 0.508: LDO_VREG.VIN 17.53,14.48 | 17.53,14.48 17.78,14.22 C7.1 | 17.53,14.48 17.78,14.73 C6.1
  Route2 0.508: FB2.2 11.68,12.32 9.53,14.48 9.53,16.51 U$5.P$1
  Bottom 0.381: FB2.2 14.35,13.72 16.51,15.88 18.92,15.88 v19.18,16.13
  other vias: 14.35,12.32
XTALIN  (via drill 0.3 pad 0.51)
  Top 0.254: IC.2 25.03,7.62 v24.77,7.62
  Route2 0.381: v24.77,7.62 24.13,6.99 23.11,6.99 22.23,6.1 20.83,6.1 20.7,5.97 19.56,5.97 19.18,6.35 17.02,6.35 16.76,6.1 C14.2
  Route15 0.508: C14.2 16.76,5.97 16.38,6.35 14.86,6.35 XTAL_RF.1
  other vias: 14.78,6.44 16.76,5.33
XTALOUT  (via drill 0.3 pad 0.51)
  Top 0.254: XTAL_RF.3 17.11,8.04 v17.14,7.75 | IC.1 25.72,6.22 v26.42,6.22 | C15.1 17.78,4.45 v18.29,3.94
  Route2 0.381: v33.27,8.38 33.27,5.08 32.38,4.19 29.59,4.19 29.21,4.57 28.45,4.57 28.19,4.32 28.19,3.68 27.56,3.05 24.89,3.05 24.38,3.56 24.38,4.06 24,4.45 22.86,4.45 22.23,3.81 18.41,3.81 v18.29,3.94
  Route15 0.508: v17.14,7.75 17.14,7.24 17.65,6.73 17.65,4.57 v18.29,3.94
  Bottom 0.254: v26.42,6.22 28.96,6.22 29.08,6.35 29.08,6.86 29.97,7.75 32.64,7.75 v33.27,8.38

### Text on the board
tPlace: FS | D1 | BOOT | CHIP | + | - | INT | D0 | ANT | 3V3 | D7 | D8 | uFL
bPlace: INT | D4 | VIN | GND | 3V3 | D3 | FSYNC | D0/I2C | D1/I2C | BOOT | r3.0.2 | PRO | FemtoBeacon | Y | Femtoduino.com | X | RESET | SWDIO | 3V3 | D7/I2C | GND | D8/I2C | SWCLK